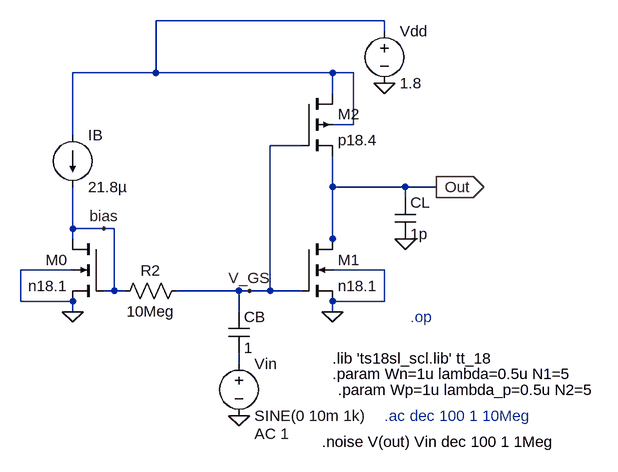
[diagram p0: schematic Q4_e.asc]
Q4_e.asc, the LTspice schematic file:
Version 4.1
SHEET 1 880 680
WIRE 448 -80 96 -80
WIRE 448 -64 448 -80
WIRE 96 0 96 -80
WIRE 96 0 -32 0
WIRE 368 0 96 0
WIRE 400 0 368 0
WIRE 368 32 368 0
WIRE 400 80 400 0
WIRE 400 80 368 80
WIRE -32 96 -32 0
WIRE 320 112 272 112
WIRE 368 176 368 128
WIRE 480 176 368 176
WIRE 528 176 480 176
WIRE 480 192 480 176
WIRE -32 240 -32 176
WIRE 16 240 -32 240
WIRE 32 240 16 240
WIRE -32 256 -32 240
WIRE 368 256 368 176
WIRE 368 272 368 256
WIRE -32 304 -112 304
WIRE 448 304 368 304
WIRE 32 336 32 240
WIRE 32 336 16 336
WIRE 48 336 32 336
WIRE 224 336 128 336
WIRE 240 336 224 336
WIRE 272 336 272 112
WIRE 272 336 240 336
WIRE 320 336 272 336
WIRE -112 352 -112 304
WIRE -32 352 -112 352
WIRE 448 352 448 304
WIRE 448 352 368 352
WIRE -32 368 -32 352
WIRE 224 368 224 336
WIRE 368 368 368 352
WIRE 224 448 224 432
FLAG 448 16 0
FLAG 368 368 0
FLAG 224 528 0
FLAG -32 368 0
FLAG 528 176 Out
IOPIN 528 176 Out
FLAG 480 256 0
FLAG 240 336 V_GS
FLAG 16 240 bias
SYMBOL voltage 448 -80 R0
WINDOW 123 0 0 Left 0
WINDOW 39 0 0 Left 0
SYMATTR InstName Vdd
SYMATTR Value 1.8
SYMBOL nmos4 320 256 R0
SYMATTR InstName M1
SYMATTR Value n18.1
SYMATTR Value2 l={2*lambda} w={N1*Wn} ad={5*lambda*Wn} as={5*lambda*Wn} pd={2*Wn + 10*lambda} ps={2*Wn + 10*lambda}
SYMBOL cap 208 368 R0
SYMATTR InstName CB
SYMATTR Value 1
SYMBOL voltage 224 432 R0
WINDOW 123 24 124 Left 2
WINDOW 39 0 0 Left 0
SYMATTR Value2 AC 1
SYMATTR InstName Vin
SYMATTR Value SINE(0 10m 1k)
SYMBOL nmos4 16 256 M0
SYMATTR InstName M0
SYMATTR Value n18.1
SYMATTR Value2 l={2*lambda} w={Wn} ad={5*lambda*Wn} as={5*lambda*Wn} pd={2*Wn + 10*lambda} ps={2*Wn + 10*lambda}
SYMBOL current -32 96 R0
WINDOW 123 0 0 Left 0
WINDOW 39 0 0 Left 0
SYMATTR InstName IB
SYMATTR Value 21.8µ
SYMBOL pmos4 320 32 R0
SYMATTR InstName M2
SYMATTR Value p18.4
SYMATTR Value2 l={2*lambda_p} w={4*N2*Wp} ad={5*lambda_p*Wp} as={5*lambda_p*Wp} pd={2*Wp + 10*lambda_p} ps={2*Wp + 10*lambda_p}
SYMBOL cap 464 192 R0
SYMATTR InstName CL
SYMATTR Value 1p
SYMBOL res 144 320 R90
WINDOW 0 0 56 VBottom 2
WINDOW 3 32 56 VTop 2
SYMATTR InstName R2
SYMATTR Value 10Meg
TEXT 368 464 Left 2 !.param Wn=1u lambda=0.5u N1=5
TEXT 368 440 Left 2 !.lib 'ts18sl_scl.lib' tt_18
TEXT 448 528 Left 2 ;.ac dec 100 1 10Meg
TEXT 376 488 Left 2 !.param Wp=1u lambda_p=0.5u N2=5
TEXT 352 568 Left 2 !.noise V(out) Vin dec 100 1 1Meg
TEXT 488 376 Left 2 ;.op

The netlist it stands for:
* Q4_e.asc
Vdd N001 0 1.8
M1 Out V_GS 0 0 n18.1 l={2*lambda} w={N1*Wn} ad={5*lambda*Wn} as={5*lambda*Wn} pd={2*Wn + 10*lambda} ps={2*Wn + 10*lambda}
CB V_GS N002 1
Vin N002 0 SINE(0 10m 1k) AC 1
M0 bias bias 0 0 n18.1 l={2*lambda} w={Wn} ad={5*lambda*Wn} as={5*lambda*Wn} pd={2*Wn + 10*lambda} ps={2*Wn + 10*lambda}
IB N001 bias 21.8µ
M2 N001 V_GS Out N001 p18.4 l={2*lambda_p} w={4*N2*Wp} ad={5*lambda_p*Wp} as={5*lambda_p*Wp} pd={2*Wp + 10*lambda_p} ps={2*Wp + 10*lambda_p}
CL Out 0 1p
R2 V_GS bias 10Meg
.model NMOS NMOS
.model PMOS PMOS
.lib standard.mos
.param Wn=1u lambda=0.5u N1=5
.lib 'ts18sl_scl.lib' tt_18
* .ac dec 100 1 10Meg
.param Wp=1u lambda_p=0.5u N2=5
.noise V(out) Vin dec 100 1 1Meg
* .op
.backanno
.end